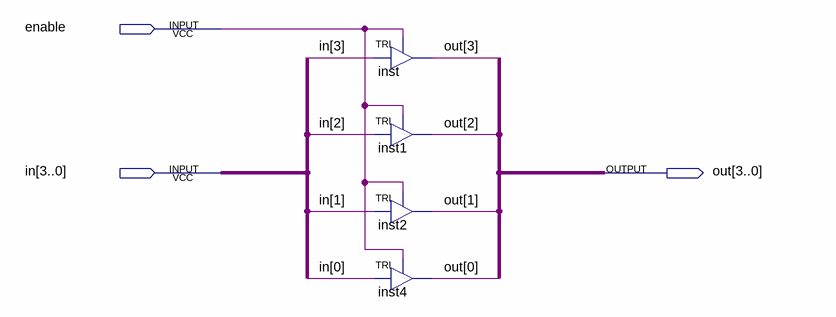
[diagram p0: schematic sheet]
// Quartus schematic Tristate4bits.bdf as structural Verilog: 4 symbols, 3 pins
module Tristate4bits (
  input  enable,
  input  [3:0] in,
  output [3:0] out
);

  TRI inst (.IN(in[3]), .OE(enable), .OUT(out[3]));
  TRI inst1 (.IN(in[2]), .OE(enable), .OUT(out[2]));
  TRI inst2 (.IN(in[1]), .OE(enable), .OUT(out[1]));
  TRI inst4 (.IN(in[0]), .OE(enable), .OUT(out[0]));
endmodule
